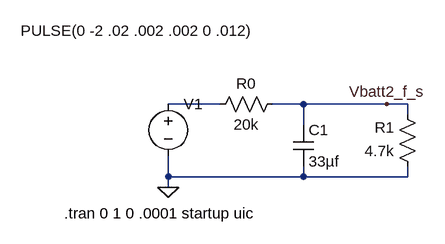
[diagram p0: schematic lpf_Vbatt2.asc]
lpf_Vbatt2.asc, the LTspice schematic file:
Version 4
SHEET 1 880 680
WIRE 48 96 -32 96
WIRE 176 96 128 96
WIRE 304 96 176 96
WIRE 336 96 304 96
WIRE 336 112 336 96
WIRE 176 128 176 96
WIRE -32 208 -32 176
WIRE 176 208 176 192
WIRE 176 208 -32 208
WIRE 336 208 336 192
WIRE 336 208 176 208
WIRE -32 224 -32 208
FLAG -32 224 0
FLAG 304 96 Vbatt2_f_s
SYMBOL cap 160 128 R0
SYMATTR InstName C1
SYMATTR Value 33µf
SYMBOL voltage -32 80 R0
WINDOW 123 0 0 Left 0
WINDOW 39 0 0 Left 0
WINDOW 3 -227 -97 Left 2
SYMATTR Value PULSE(0 -2 .02 .002 .002 0 .012)
SYMATTR InstName V1
SYMBOL res 144 80 R90
WINDOW 0 0 56 VBottom 2
WINDOW 3 32 56 VTop 2
SYMATTR InstName R0
SYMATTR Value 20k
SYMBOL res 352 208 R180
WINDOW 0 36 76 Left 2
WINDOW 3 36 40 Left 2
SYMATTR InstName R1
SYMATTR Value 4.7k
TEXT -192 264 Left 2 !.tran 0 1 0 .0001 startup uic

The netlist it stands for:
* lpf_Vbatt2.asc
C1 Vbatt2_f_s 0 33µf
V1 N001 0 PULSE(0 -2 .02 .002 .002 0 .012)
R0 Vbatt2_f_s N001 20k
R1 0 Vbatt2_f_s 4.7k
.tran 0 1 0 .0001 startup uic
.backanno
.end